# EAGLE design Thermocouple-board (EAGLE 9.3.1)
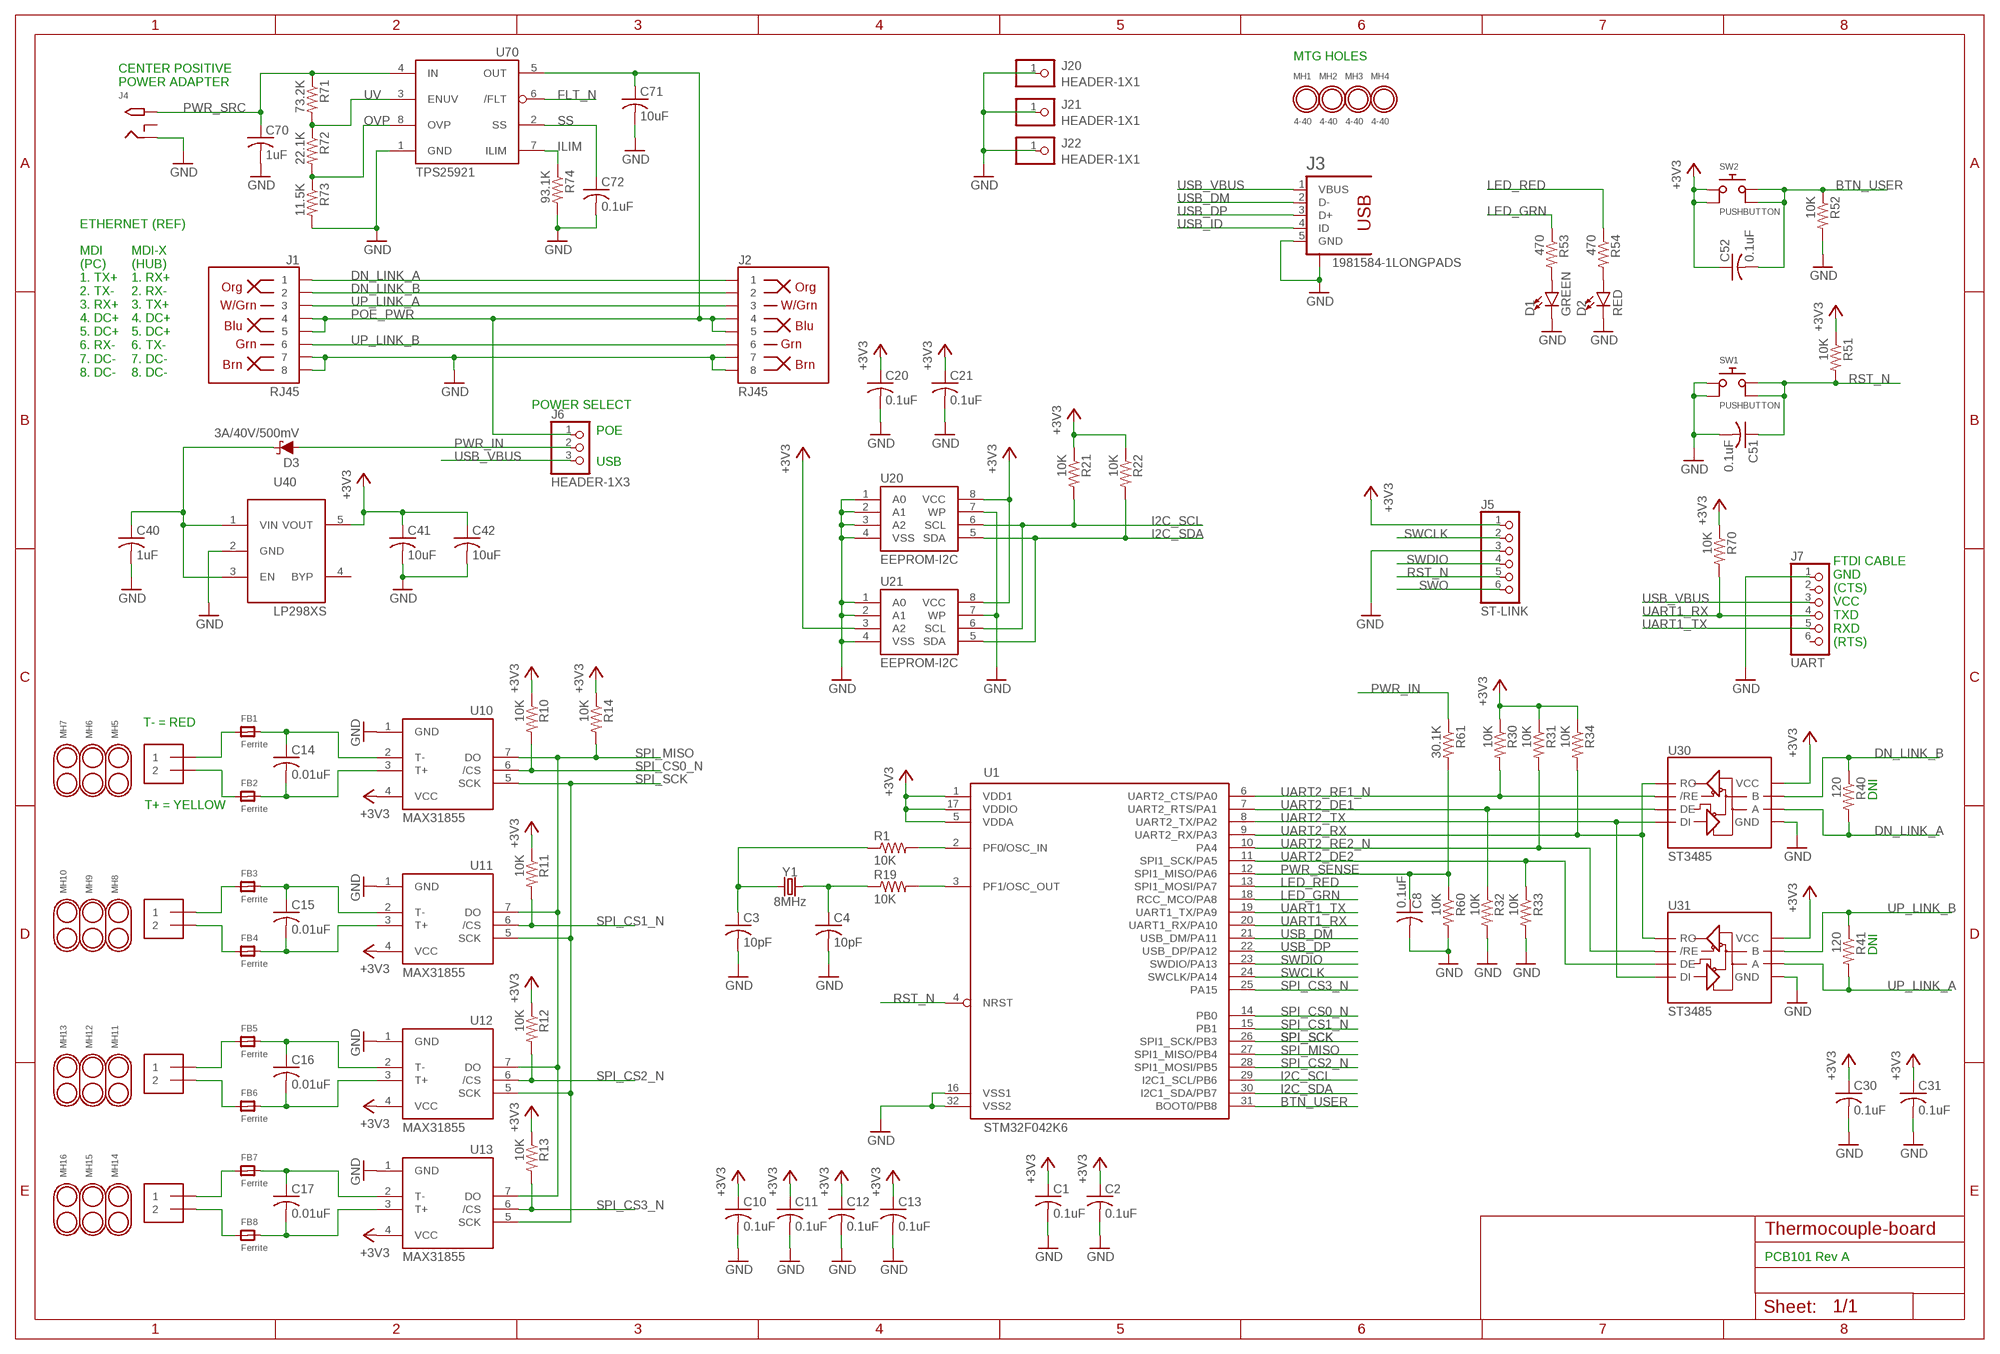
[diagram p0: schematic, sheet 1]

## Parts
C1  0.1uF  C-USC0805K  [C0805K]
C2  0.1uF  C-USC0805K  [C0805K]
C3  10pF  C-USC0805K  [C0805K]
C4  10pF  C-USC0805K  [C0805K]
C8  0.1uF  C-USC0805K  [C0805K]
C10  0.1uF  C-USC0805K  [C0805K]
C11  0.1uF  C-USC0805K  [C0805K]
C12  0.1uF  C-USC0805K  [C0805K]
C13  0.1uF  C-USC0805K  [C0805K]
C14  0.01uF  C-USC0805K  [C0805K]
C15  0.01uF  C-USC0805K  [C0805K]
C16  0.01uF  C-USC0805K  [C0805K]
C17  0.01uF  C-USC0805K  [C0805K]
C20  0.1uF  C-USC0805K  [C0805K]
C21  0.1uF  C-USC0805K  [C0805K]
C30  0.1uF  C-USC0805K  [C0805K]
C31  0.1uF  C-USC0805K  [C0805K]
C40  1uF  C-USC0805K  [C0805K]
C41  10uF  C-USC0805K  [C0805K]
C42  10uF  C-USC0805K  [C0805K]
C51  0.1uF  C-USC0805K  [C0805K]
C52  0.1uF  C-USC0805K  [C0805K]
C70  1uF  C-USC0805K  [C0805K]
C71  10uF  C-USC0805K  [C0805K]
C72  0.1uF  C-USC0805K  [C0805K]
D1  GREEN  LED-GREEN0603  [LED-0603]
D2  RED  LED-RED0603  [LED-0603]
D3  3A/40V/500mV  DIODE-SCHOTTKY-B340A  [SMA-DIODE]
FB1  Ferrite  FERRITE_0805  [_0805]
FB2  Ferrite  FERRITE_0805  [_0805]
FB3  Ferrite  FERRITE_0805  [_0805]
FB4  Ferrite  FERRITE_0805  [_0805]
FB5  Ferrite  FERRITE_0805  [_0805]
FB6  Ferrite  FERRITE_0805  [_0805]
FB7  Ferrite  FERRITE_0805  [_0805]
FB8  Ferrite  FERRITE_0805  [_0805]
J1  RJ45  RJ45-8  [RJ45-8]
J2  RJ45  RJ45-8  [RJ45-8]
J3  1981584-1LONGPADS  [1981584-1-LONG]
J4  2.1MMJACKTHM  [PJ-102A]
J5  ST-LINK  HEADER-1X6  [1X06_OVAL]
J6  HEADER-1X3  [1X03_OVAL]
J7  UART  HEADER-1X6  [1X06_OVAL]
J10  1X2-3.5MM  [1X2-3.5MM]
J11  1X2-3.5MM  [1X2-3.5MM]
J12  1X2-3.5MM  [1X2-3.5MM]
J13  1X2-3.5MM  [1X2-3.5MM]
J20  HEADER-1X1  [1X01_OVAL]
J21  HEADER-1X1  [1X01_OVAL]
J22  HEADER-1X1  [1X01_OVAL]
MH1  4-40  MTG_HOLE_4-40  [MTG_HOLE_C280_H125]
MH2  4-40  MTG_HOLE_4-40  [MTG_HOLE_C280_H125]
MH3  4-40  MTG_HOLE_4-40  [MTG_HOLE_C280_H125]
MH4  4-40  MTG_HOLE_4-40  [MTG_HOLE_C280_H125]
MH5  HOLD_DOWN  [HOLD_DOWN]
MH6  HOLD_DOWN  [HOLD_DOWN]
MH7  HOLD_DOWN  [HOLD_DOWN]
MH8  HOLD_DOWN  [HOLD_DOWN]
MH9  HOLD_DOWN  [HOLD_DOWN]
MH10  HOLD_DOWN  [HOLD_DOWN]
MH11  HOLD_DOWN  [HOLD_DOWN]
MH12  HOLD_DOWN  [HOLD_DOWN]
MH13  HOLD_DOWN  [HOLD_DOWN]
MH14  HOLD_DOWN  [HOLD_DOWN]
MH15  HOLD_DOWN  [HOLD_DOWN]
MH16  HOLD_DOWN  [HOLD_DOWN]
R1  10K  R-US_R0805  [R0805]
R10  10K  R-US_R0805  [R0805]
R11  10K  R-US_R0805  [R0805]
R12  10K  R-US_R0805  [R0805]
R13  10K  R-US_R0805  [R0805]
R14  10K  R-US_R0805  [R0805]
R19  10K  R-US_R0805  [R0805]
R21  10K  R-US_R0805  [R0805]
R22  10K  R-US_R0805  [R0805]
R30  10K  R-US_R0805  [R0805]
R31  10K  R-US_R0805  [R0805]
R32  10K  R-US_R0805  [R0805]
R33  10K  R-US_R0805  [R0805]
R34  10K  R-US_R0805  [R0805]
R40  120  R-US_R0805  [R0805]
R41  120  R-US_R0805  [R0805]
R51  10K  R-US_R0805  [R0805]
R52  10K  R-US_R0805  [R0805]
R53  470  R-US_R0805  [R0805]
R54  470  R-US_R0805  [R0805]
R60  10K  R-US_R0805  [R0805]
R61  30.1K  R-US_R0805  [R0805]
R70  10K  R-US_R0805  [R0805]
R71  73.2K  R-US_R0805  [R0805]
R72  22.1K  R-US_R0805  [R0805]
R73  11.5K  R-US_R0805  [R0805]
R74  93.1K  R-US_R0805  [R0805]
SW1  PUSHBUTTON  [PUSHBUTTON_6X6MM]
SW2  PUSHBUTTON  [PUSHBUTTON_6X6MM]
U1  STM32F042K6  STM32F042K4_V02  [TQFP32-0.8MM]
U10  MAX31855  [SO08]
U11  MAX31855  [SO08]
U12  MAX31855  [SO08]
U13  MAX31855  [SO08]
U20  EEPROM-I2C  [SO08]
U21  EEPROM-I2C  [SO08]
U30  ST3485  RS485SOIC  [SO08]
U31  ST3485  RS485SOIC  [SO08]
U40  LP298XS  [SOT23-5L]
U70  TPS25921  [SO08]
Y1  8MHz  CRYSTAL-8MHZSMD-HC49UP  [HC49UP]

## Nets
+3V3: C1.1 C2.1 C10.1 C11.1 C12.1 C13.1 C20.1 C21.1 C30.1 C31.1 C41.1 C42.1 C52.1 J5.1 R10.1 R11.1 R12.1 R13.1 R14.1 R21.1 R22.1 R30.1 R31.1 R34.1 R51.1 R70.1 SW2.1 SW2.2 U1.1(VDD1) U1.5(VDDA) U1.17(VDDIO) U10.4(VCC) U11.4(VCC) U12.4(VCC) U13.4(VCC) U20.8(VCC) U21.3(A2) U21.8(VCC) U30.8(VCC) U31.8(VCC) U40.5(VOUT)
BTN_USER: C52.2 R52.1 SW2.3 SW2.4 U1.31(BOOT0/PB8)
DN_LINK_A: J1.1 J2.1 R40.2 U30.6(A)
DN_LINK_B: J1.2 J2.2 R40.1 U30.7(B)
FLT_N: U70.6(/FLT)
GND: C1.2 C2.2 C3.2 C4.2 C8.2 C10.2 C11.2 C12.2 C13.2 C20.2 C21.2 C30.2 C31.2 C40.2 C41.2 C42.2 C51.2 C70.2 C71.2 C72.2 D1.C D2.C J1.7 J1.8 J2.7 J2.8 J3.5(GND) J3.S1 J4.RING J5.3 J7.1 J20.1 J21.1 J22.1 R32.2 R33.2 R52.2 R60.2 R73.2 R74.2 SW1.1 SW1.2 U1.16(VSS1) U1.32(VSS2) U10.1(GND) U11.1(GND) U12.1(GND) U13.1(GND) U20.1(A0) U20.2(A1) U20.3(A2) U20.4(VSS) U20.7(WP) U21.1(A0) U21.2(A1) U21.4(VSS) U21.7(WP) U30.5(GND) U31.5(GND) U40.2(GND) U70.1(GND)
I2C_SCL: R21.2 U1.29(I2C1_SCL/PB6) U20.6(SCL) U21.6(SCL)
I2C_SDA: R22.2 U1.30(I2C1_SDA/PB7) U20.5(SDA) U21.5(SDA)
ILIM: R74.1 U70.7(ILIM)
LED_GRN: R53.1 U1.18(RCC_MCO/PA8)
LED_RED: R54.1 U1.13(SPI1_MOSI/PA7)
N$1: FB1.1 J10.1
N$2: R1.2 U1.2(PF0/OSC_IN)
N$3: R19.2 U1.3(PF1/OSC_OUT)
N$4: C14.1 FB1.2 U10.2(T-)
N$5: FB2.1 J10.2
N$6: C14.2 FB2.2 U10.3(T+)
N$7: FB3.1 J11.1
N$8: C15.1 FB3.2 U11.2(T-)
N$9: FB4.1 J11.2
N$10: C15.2 FB4.2 U11.3(T+)
N$11: FB5.1 J12.1
N$12: C16.1 FB5.2 U12.2(T-)
N$13: FB6.1 J12.2
N$14: C16.2 FB6.2 U12.3(T+)
N$15: FB7.1 J13.1
N$16: C17.1 FB7.2 U13.2(T-)
N$17: FB8.1 J13.2
N$18: C17.2 FB8.2 U13.3(T+)
N$19: C4.1 R19.1 Y1.2
N$20: C3.1 R1.1 Y1.1
N$21: C40.1 D3.C U40.1(VIN) U40.3(EN)
N$25: D1.A R53.2
N$26: D2.A R54.2
OVP: R72.2 R73.1 U70.8(OVP)
POE_PWR: C71.1 J1.4 J1.5 J2.4 J2.5 J6.1 U70.5(OUT)
PWR_IN: D3.A J6.2 R61.1
PWR_SENSE: C8.1 R60.1 R61.2 U1.12(SPI1_MISO/PA6)
PWR_SRC: C70.1 J4.TIP R71.1 U70.4(IN)
RST_N: C51.1 J5.5 R51.2 SW1.3 SW1.4 U1.4(NRST)
SPI_CS0_N: R10.2 U1.14(PB0) U10.6(/CS)
SPI_CS1_N: R11.2 U1.15(PB1) U11.6(/CS)
SPI_CS2_N: R12.2 U1.28(SPI1_MOSI/PB5) U12.6(/CS)
SPI_CS3_N: R13.2 U1.25(PA15) U13.6(/CS)
SPI_MISO: R14.2 U1.27(SPI1_MISO/PB4) U10.7(DO) U11.7(DO) U12.7(DO) U13.7(DO)
SPI_SCK: U1.26(SPI1_SCK/PB3) U10.5(SCK) U11.5(SCK) U12.5(SCK) U13.5(SCK)
SS: C72.1 U70.2(SS)
SWCLK: J5.2 U1.24(SWCLK/PA14)
SWDIO: J5.4 U1.23(SWDIO/PA13)
SWO: J5.6
UART1_RX: J7.4 R70.2 U1.20(UART1_RX/PA10)
UART1_TX: J7.5 U1.19(UART1_TX/PA9)
UART2_DE1: R32.1 U1.7(UART2_RTS/PA1) U30.3(DE)
UART2_DE2: R33.1 U1.11(SPI1_SCK/PA5) U31.3(DE)
UART2_RE1_N: R30.2 U1.6(UART2_CTS/PA0) U30.2(/RE)
UART2_RE2_N: R31.2 U1.10(PA4) U31.2(/RE)
UART2_RX: R34.2 U1.9(UART2_RX/PA3) U30.1(RO) U31.1(RO)
UART2_TX: U1.8(UART2_TX/PA2) U30.4(DI) U31.4(DI)
UP_LINK_A: J1.3 J2.3 R41.2 U31.6(A)
UP_LINK_B: J1.6 J2.6 R41.1 U31.7(B)
USB_DM: J3.2(D-) U1.21(USB_DM/PA11)
USB_DP: J3.3(D+) U1.22(USB_DP/PA12)
USB_ID: J3.4(ID)
USB_VBUS: J3.1(VBUS) J6.3 J7.3
UV: R71.2 R72.1 U70.3(ENUV)
Unconnected: J4.RING_SW J7.2 J7.6 U40.4(BYP)

## Notes on the sheet
- MTG HOLES
- CENTER POSITIVE
  POWER ADAPTER
- ETHERNET (REF)
- MDI
  (PC)
  1. TX+
  2. TX-
  3. RX+
  4. DC+
  5. DC+
  6. RX-
  7. DC-
  8. DC-
- MDI-X
  (HUB)
  1. RX+
  2. RX-
  3. TX+
  4. DC+
  5. DC+
  6. TX-
  7. DC-
  8. DC-
- POWER SELECT
- POE
- USB
- FTDI CABLE
  GND
  (CTS)
  VCC
  TXD
  RXD
  (RTS)
- T- = RED
- DNI
- T+ = YELLOW
- DNI
- PCB101 Rev A

## Library data of the parts
C1-C4 C8 C10-C17 C20 C21 C30 C31 C40-C42 C51 C52 C70-C72 = adafruit:C-US: CAPACITOR, American symbol
D1 = SparkFun-LED:LED-GREEN: Green SMD LED Used in manufacturing of various products at SparkFun Packages: 0603 - SMD 0603 package [Product Link] <http://www.futureelectronics.com/en/technologies/semiconductors/optoelectronics/leds/Pages/9894312-LTST-C190GKT.aspx?CrossPart=HSMG-C190&IM=0> LilyPad 1206 - SMD1206 LilyPad package [Product Link] <http://www.futureelectronics.com/en/Technologies/Product.aspx?ProductID=IN150NGHARVATEKCORPORATION2049943&IM=0> 1206 - SMD1206 package [Product Link] <http://www.futureelectronics.com/en/technologies/semiconductors/optoelectronics/leds/Pages/8315665-LTST-C150KGKT.aspx?IM=0> 1206 Bottom Mount -SMD 1206 Bottom Mount [Product Link] <http://www.digikey.com/product-detail/en/lite-on-inc/LTST-C230KGKT/160-1456-1-ND/386854> SparkFun Products: Pro Mini 328 -5V <https://www.sparkfun.com/products/821> RedBoard <https://www.sparkfun.com/products/12757> MP3 Trigger <https://www.sparkfun.com/products/13720> Makey Makey <https://www.sparkfun.com/products/11076>; PROD_ID: DIO-00821
D2 = SparkFun-LED:LED-RED: Red SMD LED Used in manufacturing of most products at SparkFun Packages: 0603 - SMD 0603 package [Product Link] <http://docs.avagotech.com/docs/AV02-0551EN> 0603 SMART - SMD 0603 SMART package ( more efficient and expensive)[Product Link] <http://www.osram-os.com/Graphics/XPic2/00077099_0.pdf> 1206 - SMD1206 package [Product Link] <https://www.sparkfun.com/datasheets/DevTools/LilyPad/Q150OVS4.pdff> SparkFun Products: Pro Mini 328 -5V <https://www.sparkfun.com/products/821> RedBoard <https://www.sparkfun.com/products/12757> IOIO-OTG <https://www.sparkfun.com/products/13613>; PROD_ID: DIO-00819
D3 = SparkFun-DiscreteSemi:DIODE-SCHOTTKY: Schottky diode A Schottky diode is a semiconductor diode which has a low forward voltage drop and a very fast switching action.; PROD_ID: DIO-09886
FB1-FB8 = microbuilder:FERRITE: Ferrite Bead 0603 MMZ1608B121C - 120 Ohm @ 100MHz, 600mA, 0.15 Ohm DC Resistance - Digikey: 445-2164-1-ND BK1608HW121-T - 120 Ohm, 600mA Ferrite Chip - Digikey: 587-1876-2-ND 0805 HZ0805B272R-10 - 2.7K Ohm @ 100MHz, 200mA, 0.8 Ohm DC Resistance - Digikey: 240-2504-1-ND (see also Murata BLM21BD272SN1L) MMZ2012Y152B - 1.5K Ohm @ 100MHz, 500mA, 0.4 Ohm DC Resistance - Digikey: 445-1560-1-ND - Mainly for high frequency (80-400MHz) MMZ2012R102A - 1K Ohm @ 100MHz, 500mA, 0.3 Ohm DC Resistance - Digikey: 445-1555-2-ND - More general purpose (10-200MHz)
J1 J2 = SparkFun-Connectors:RJ45-8: RJ45 Jack - 8 pin Simple RJ45, 8-pin connection. Commonly used for Cat5, Cat5e, and Cat6 Ethernet cables. Here is the connector we sell at SparkFun: RJ45 8-Pin Connector <https://www.sparkfun.com/products/643> (PRT-00643) Datasheet <https://cdn.sparkfun.com/datasheets/Prototyping/04908.pdf> It is used on this SparkFun product: SparkFun RJ45 Breakout <https://www.sparkfun.com/products/716> (BOB-00716) Note, you may also be interested in the "MAGJACK" version of this. It is basically a RJ45 connector, but also has some status LEDs built into the connector housing. You can check that out in this library at the device named "MAGJACK.dev" and see these products online: RJ45 Ethernet MagJack-Compatible <https://www.sparkfun.com/products/8534> (PRT-08534) SparkFun RJ45 MagJack Breakout <https://www.sparkfun.com/products/13021> (BOB-13021); PROD_ID: CONN-08506; SF_ID: PRT-00643
J3 = Thermocouple-board:1981584-1: Receptacle, micro-USB, type A/B Tyco Electronics
J4 = Thermocouple-board:2.1MMJACK: 2.1mm x 5.5mm THM DC jack with internal switch. Digikey part #PJ-102A, 4UCON part #05537
J5 J7 = Thermocouple-board:HEADER-1X6: PIN HEADER
J6 = Thermocouple-board:HEADER-1X3: PIN HEADER
J10-J13 = Thermocouple-board:1X2: 3.5mm Terminal block http://www.ladyada.net/library/pcb/eaglelibrary.html
J20-J22 = Thermocouple-board:HEADER-1X1: PIN HEADER
MH1-MH4 = Thermocouple-board:MTG_HOLE
MH5-MH16 = Thermocouple-board:HOLD_DOWN
R1 R10-R14 R19 R21 R22 R30-R34 R40 R41 R51-R54 R60 R61 R70-R74 = adafruit:R-US_: RESISTOR, American symbol
SW1 SW2 = Thermocouple-board:PUSHBUTTON: C&K PTS645-Seriesl (6x6mm) SMT Tactile Pushbiutton Switch
U1 = Thermocouple-board:STM32F042K4_V02: STM32F030K6, Cortex-M0, 32K Flash, 4K SRAM, 48MHz, LQFP32 0.8mm
U10-U13 = Thermocouple-board:MAX31855: MAX31855 Cold-Junction Compensated Thermocouple-to-Digital Converter
U20 U21 = Thermocouple-board:EEPROM-I2C
U30 U31 = SparkFun-IC-Comms:RS485: RS-485 Transceiver SP3485 Series 8 Pin NSOIC 3.3 V Low Power Half Duplex RS-485 Transceiver MAX3485 compatible Datasheet <http://www.sparkfun.com/datasheets/Components/General/sp3485CN-LTR.pdf> SparkFun Products SparkFun Transceiver Breakout - RS-485 <https://www.sparkfun.com/products/10124> (BOB-10124) SparkFun USB to RS-485 Converter <https://www.sparkfun.com/products/9822> (BOB-09822); PROD_ID: IC-09388; VALUE: MAX3485CSA
U40 = adafruit:LP298X
U70 = Thermocouple-board:TPS25921: TPS25921 4.5V to 18V eFuse with Current Limit and Over Voltage Protection in SOIC 8-pin.
Y1 = SparkFun-Clocks:CRYSTAL-8MHZ: 8MHz Crystal Datasheet Example <http://www.futureelectronics.com/en/technologies/electromechanical/timing-devices/crystals/Pages/6008189-ABM3B-8.000MHZ-B2-T.aspx?IM=0> Frequency: 8MHz Frequency Tolerance: ±20ppm Load Capacitance: 18pF SparkFun Products: Pro Micro -3.3V/8MHz <https://www.sparkfun.com/products/12587> WAV Trigger <https://www.sparkfun.com/products/13660>; PROD_ID: XTAL-11706

## Net classes
0 default: width 0.203 mm, clearance 0.203 mm
1 pwr_gnd: width 0.813 mm, clearance 0.254 mm

## Board
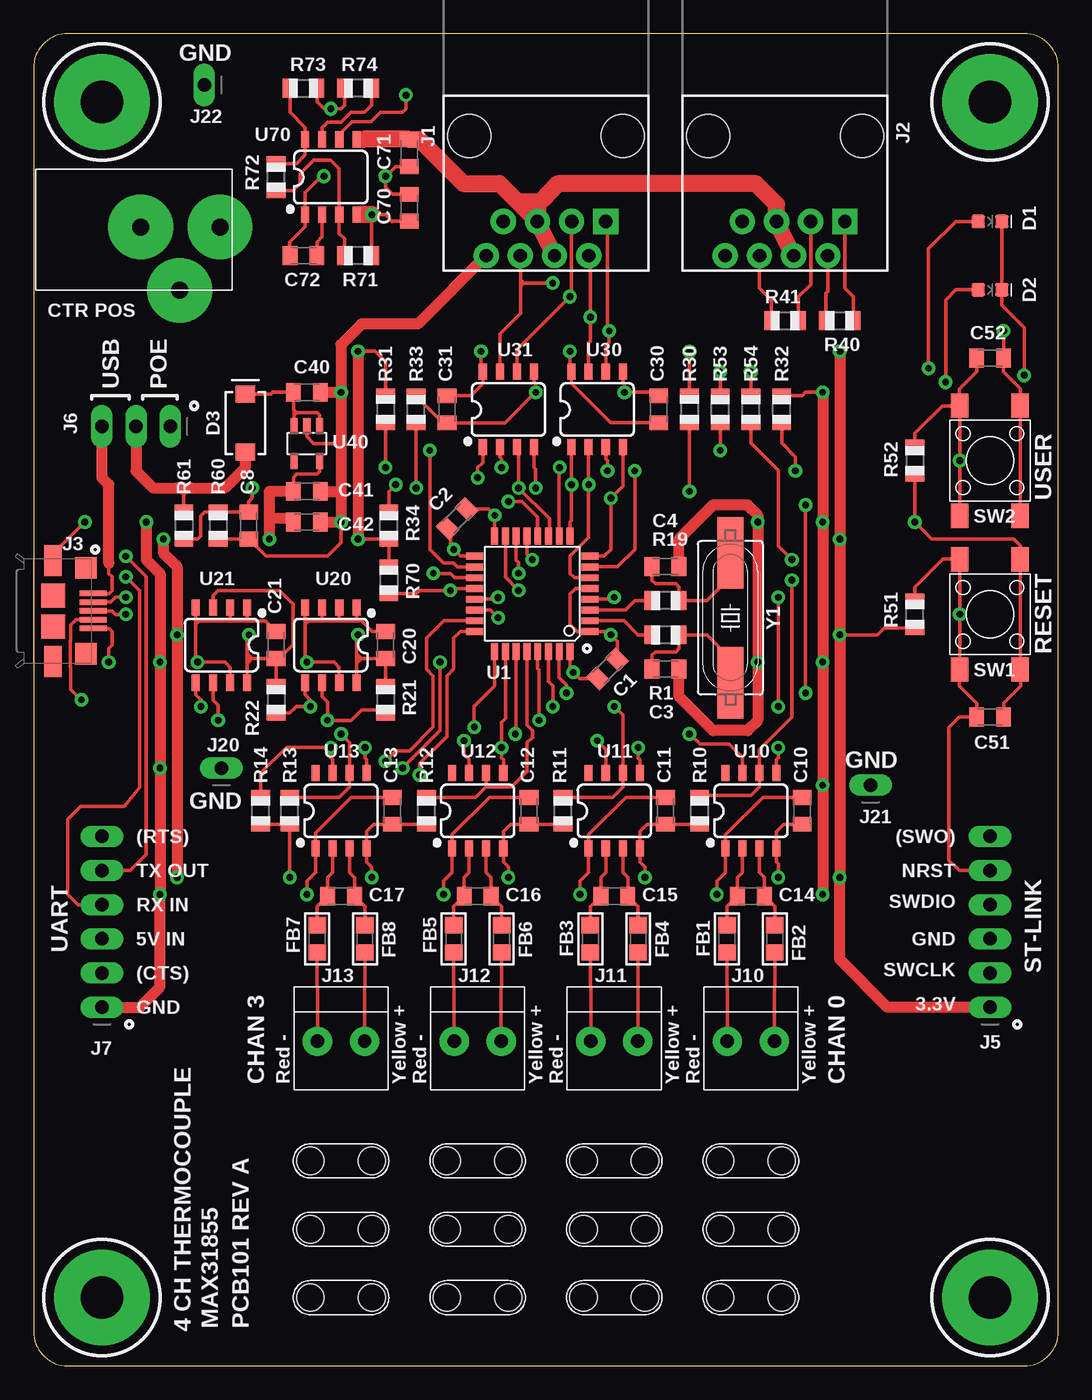
[diagram p1: board, top side]
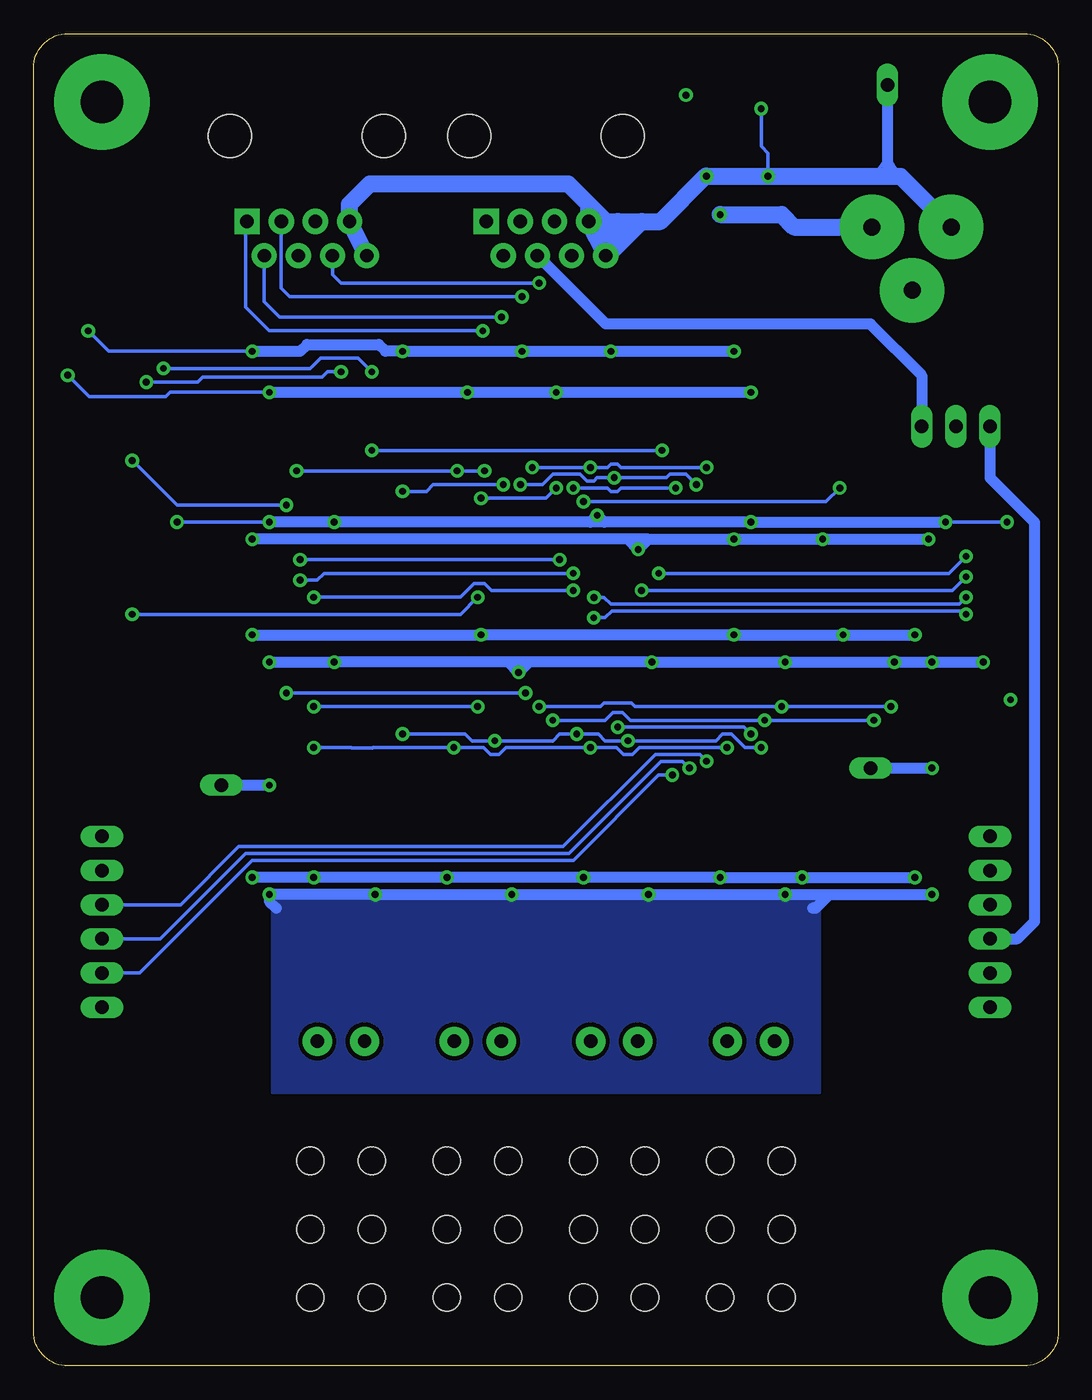
[diagram p2: board, bottom side, seen from below]

Size 76.2 x 99.06 mm. Coordinates in mm from the lower left corner, seen from the top.
Outline: 76.2,96.52 arc90 73.66,99.06 2.54,99.06 arc90 0,96.52 0,2.54 arc90 2.54,0 73.66,0 arc90 76.2,2.54 76.2,96.52
Copper layers (1*16): Top 0.035mm / dielectric 1.5mm / Bottom 0.035mm
Design rules "SparkFun-design-rules *": minimum track width 8mil, minimum drill 20mil, track to track 10mil, track to pad 8mil, pad to pad 8mil, via to via 10mil, smd to smd 8mil, copper to edge 10mil, drill to drill 8mil, minimum pad ring 12mil, minimum via ring 10mil, stop-mask expansion 4mil, vias tented up to drill 25mil, thermal gap 10mil

### Footprints (pad centres in the part's own frame; a part is rotated, then mirrored left to right if it is on the bottom)
C0805K = smd 1.1 x 1.4: 1 -1,0; 2 1,0
LED-0603 = smd 1 x 1: A -0.877,0; C 0.877,0
SMA-DIODE = smd 1.27 x 1.47: A -2.15,0; C 2.15,0
_0805 = smd 1.2 x 1.3: 1 -1.016,0; 2 1.016,0
RJ45-8 = drill 1 pad 1.88 square: 1 -4.445,6.35 | drill 1 pad 1.88: 2 -3.175,8.89; 3 -1.905,6.35; 4 -0.635,8.89; 5 0.635,6.35; 6 1.905,8.89; 7 3.175,6.35; 8 4.445,8.89 | hole 3.2: -5.715,0; 5.715,0
1981584-1-LONG = smd 0.4 x 2: 1 -1.3,4.425; 2 -0.65,4.425; 3 0,4.425; 4 0.65,4.425; 5 1.3,4.425 | smd 1.8 x 1.8: M1 -1.15,1.45; M2 1.15,1.45 | smd 2.3 x 1.3: S1 -3.75,1.45; S2 3.75,1.45 | smd 1.6 x 1.6: S3 -3.2,3.885; S4 3.2,3.885
PJ-102A = drill 1.27 pad 4.8: RING 0.1,-3.39; RING_SW -4.6,-6.29; TIP 0.1,-9.29
1X06_OVAL = drill 1 long: 1 -6.35,0; 2 -3.81,0; 3 -1.27,0; 4 1.27,0; 5 3.81,0; 6 6.35,0
1X03_OVAL = drill 1 long: 1 -2.54,0; 2 0,0; 3 2.54,0
1X2-3.5MM = drill 1 pad 2.184: 1 1.75,0; 2 -1.75,0
1X01_OVAL = drill 1 long: 1 0,0
MTG_HOLE_C280_H125 = drill 3.175 pad 7.112: 1 0,0
HOLD_DOWN = hole 2.032: 2.286,0; -2.286,0
R0805 = smd 1.1 x 1.4: 1 -1,0; 2 1,0
PUSHBUTTON_6X6MM = smd 1.8 x 1.3: 1 -4.1,2.25; 2 4.1,2.25; 3 -4.1,-2.25; 4 4.1,-2.25
TQFP32-0.8MM = smd 1.27 x 0.508: 1 -4.293,2.8; 2 -4.293,2; 3 -4.293,1.2; 4 -4.293,0.4; 5 -4.293,-0.4; 6 -4.293,-1.2; 7 -4.293,-2; 8 -4.293,-2.8; 17 4.293,-2.8; 18 4.293,-2; 19 4.293,-1.2; 20 4.293,-0.4; 21 4.293,0.4; 22 4.293,1.2; 23 4.293,2; 24 4.293,2.8 | smd 0.508 x 1.27: 9 -2.8,-4.293; 10 -2,-4.293; 11 -1.2,-4.293; 12 -0.4,-4.293; 13 0.4,-4.293; 14 1.2,-4.293; 15 2,-4.293; 16 2.8,-4.293; 25 2.8,4.293; 26 2,4.293; 27 1.2,4.293; 28 0.4,4.293; 29 -0.4,4.293; 30 -1.2,4.293; 31 -2,4.293; 32 -2.8,4.293
SO08 = smd 0.6 x 1.2: 1 -1.905,-2.8; 2 -0.635,-2.8; 3 0.635,-2.8; 4 1.905,-2.8; 5 1.905,2.8; 6 0.635,2.8; 7 -0.635,2.8; 8 -1.905,2.8
SOT23-5L = smd 0.55 x 1.2: 1 -0.95,-1.3; 2 0,-1.3; 3 0.95,-1.3; 4 0.95,1.3; 5 -0.95,1.3
HC49UP = smd 5.334 x 1.93: 1 -4.826,0; 2 4.826,0

### Placement (x,y rotation side)
C1  42.67,51.82 225 top
C2  31.5,62.99 45 top
C3  46.99,51.82 0 top
C4  46.99,59.44 0 top
C8  16,62.48 270 top
C10  57.15,41.27 90 top
C11  46.99,41.27 90 top
C12  36.83,41.27 90 top
C13  26.67,41.27 90 top
C14  53.34,34.92 0 top
C15  43.18,34.92 0 top
C16  33.02,34.92 0 top
C17  22.86,34.92 0 top
C20  26.16,53.59 90 top
C21  18.03,53.59 90 top
C30  46.48,71.12 90 top
C31  30.73,71.12 270 top
C40  20.32,72.39 0 top
C41  20.32,65.02 0 top
C42  20.32,62.74 0 top
C51  71.12,48.26 0 top
C52  71.12,74.93 180 top
C70  27.94,86.11 90 top
C71  27.94,90.17 270 top
C72  20.07,82.55 180 top
D1  71.12,85.09 0 top
D2  71.12,80.01 0 top
D3  15.75,70.1 90 top
FB1  51.56,31.75 90 top
FB2  55.12,31.75 90 top
FB3  41.4,31.75 90 top
FB4  44.96,31.75 90 top
FB5  31.24,31.75 90 top
FB6  34.8,31.75 90 top
FB7  21.08,31.75 90 top
FB8  24.64,31.75 90 top
J1  38.1,91.44 180 top
J2  55.88,91.44 180 top
J3  0,56.13 270 top
J4  4.57,84.58 90 top
J5  71.12,33.02 90 top
J6  7.62,69.85 180 top
J7  5.08,33.02 90 top
J10  53.34,24.13 180 top
J11  43.18,24.13 180 top
J12  33.02,24.13 180 top
J13  22.86,24.13 180 top
J20  13.97,44.45 90 top
J21  62.23,43.18 90 top
J22  12.7,95.25 180 top
MH1  5.08,5.08 0 top
MH2  71.12,5.08 0 top
MH3  5.08,93.98 0 top
MH4  71.12,93.98 0 top
MH5  53.34,15.24 0 top
MH6  53.34,10.16 0 top
MH7  53.34,5.08 0 top
MH8  43.18,15.24 0 top
MH9  43.18,10.16 0 top
MH10  43.18,5.08 0 top
MH11  33.02,15.24 0 top
MH12  33.02,10.16 0 top
MH13  33.02,5.08 0 top
MH14  22.86,15.24 0 top
MH15  22.86,10.16 0 top
MH16  22.86,5.08 0 top
R1  46.99,54.36 180 top
R10  49.53,41.27 90 top
R11  39.37,41.27 90 top
R12  29.21,41.27 90 top
R13  19.05,41.27 90 top
R14  16.89,41.27 90 top
R19  46.99,56.9 180 top
R21  26.16,49.53 270 top
R22  18.03,49.53 270 top
R30  48.77,71.12 270 top
R31  26.16,71.12 270 top
R32  55.63,71.12 90 top
R33  28.45,71.12 90 top
R34  26.42,62.48 90 top
R40  59.94,77.72 0 top
R41  55.88,77.72 0 top
R51  65.53,55.88 90 top
R52  65.53,67.31 270 top
R53  51.05,71.12 90 top
R54  53.34,71.12 90 top
R60  13.72,62.48 270 top
R61  11.18,62.48 270 top
R70  26.42,58.42 270 top
R71  24.13,82.55 180 top
R72  18.03,88.39 90 top
R73  20.07,95 0 top
R74  24.13,95 180 top
SW1  71.12,55.88 270 top
SW2  71.12,67.31 270 top
U1  37.08,57.4 180 top
U10  53.34,41.27 0 top
U11  43.18,41.27 0 top
U12  33.02,41.27 0 top
U13  22.86,41.27 0 top
U20  22.1,53.59 180 top
U21  13.97,53.59 180 top
U30  41.91,71.12 0 top
U31  35.31,71.12 0 top
U40  20.32,68.58 180 top
U70  22.1,88.39 0 top
Y1  51.82,55.63 90 top

### Tracks (layer width: path | path; a pad name or v marks a point on that pad's centre or on a via)
+3V3  (via drill 0.51)
  Top 0.254: v25.15,36.32 25.15,37.08 24.77,37.47 U13.4 24.77,39.75 25.29,40.27 C13.1 R12.1 | C31.1 30.75,72.14 32.51,72.14 33.4,73.03 U31.8 33.4,74.04 33.27,74.17 v33.27,75.44 | C30.1 42.91,70.12 40.01,73.03 U30.8 40.01,74.04 39.88,74.17 v39.88,75.44 | v48.77,75.44 R30.1 | C2.1 30.99,62.09 30.99,60.96 v31.24,60.71 31.74,60.2 U1.17 | R10.1 C11.1 45.61,40.27 45.09,39.75 U11.4 45.09,37.47 45.47,37.08 v45.47,36.32 | R14.1 R13.1 v19.05,36.32 | R11.1 C12.1 35.45,40.27 34.92,39.75 U12.4 34.92,37.47 35.31,37.08 v35.31,36.32 | U1.5 40.28,57.8 39.88,57.4 39.88,55.12 40.39,54.6 U1.1 42.68,54.6 v42.93,54.36 43.43,53.85 43.43,52.58 C1.1 | C21.1 18.26,52.59 19.3,53.64 19.3,56.64 18.29,57.66 13.72,57.66 13.34,57.28 U21.3 | R21.1 C20.1 24.38,52.59 | R22.1 C21.1 | U40.5 21.27,66.48 21.08,66.29 19.56,66.29 19.32,66.06 C41.1 | v24.13,75.44 25.4,75.44 26.16,74.68 R31.1 | v24.13,61.47 26.4,61.47 R34.1 R70.1 | SW2.2 SW2.1 73.37,72.68 72.12,73.93 C52.1 71.87,75.18 72.14,75.45 v72.14,76.96 | v55.37,36.32 55.37,37.34 55.24,37.47 U10.4 55.24,39.75 55.77,40.27 C10.1 | U20.8 24,52.07 24,52.21 | 24,52.21 24,52.59 | 24,52.59 24.38,52.59 | 24,52.59 24,52.98 | 24,52.98 24,54.23 v24.13,54.36 | U21.8 15.88,52.2 | 15.88,52.2 15.88,52.58 | 15.88,52.58 15.88,52.96 | 15.88,52.96 15.88,54.23 v16,54.36 | C21.1 18.02,52.58 16.26,52.58 | 16.26,52.58 15.88,52.58 | v59.94,54.36 62.74,54.36 63.26,54.88 R51.1 | 16.26,52.58 15.88,52.96 | 16.26,52.58 15.88,52.2 | 24.38,52.59 24,52.98 | 24.38,52.59 24,52.21
  Top 0.813: v9.65,61.47 9.65,60.45 10.67,59.44 v10.67,54.36 v10.67,36.32 | v59.94,75.44 v59.94,61.47 v59.94,54.36 v59.94,36.32 59.94,30.23 63.5,26.67 J5.1 | v24.13,75.44 v24.13,61.47 | 17.53,62.99 17.53,65.02 C41.1 | 17.53,62.99 v17.53,61.47 | C42.1 19.07,62.99 17.53,62.99
  Bottom 0.254: v59.94,75.44 70.61,75.44 v72.14,76.96
  Bottom 0.813: v24.13,75.44 v33.27,75.44 v39.88,75.44 v48.77,75.44 50.04,75.44 50.55,75.95 55.88,75.95 56.39,75.44 v59.94,75.44 | 30.48,61.47 v24.13,61.47 v17.53,61.47 v9.65,61.47 | 30.48,61.47 v31.24,60.71 32,61.47 | v10.67,36.32 v19.05,36.32 v25.15,36.32 v35.31,36.32 v45.47,36.32 v55.37,36.32 v59.94,36.32 | 32,61.47 v59.94,61.47 | 30.48,61.47 32,61.47 | v59.94,54.36 v42.93,54.36 v24.13,54.36 v16,54.36 v10.67,54.36
BTN_USER  (via drill 0.51)
  Top 0.254: v57.4,64.01 v57.4,50.04 | v39.62,50.04 39.62,50.63 39.08,51.17 U1.31 | SW2.4 v68.87,67.31 SW2.3 | SW2.3 68.83,71.45 68.83,72.64 70.12,73.93 C52.2 | SW2.3 68.83,71.37 67.56,71.37 65.53,69.34 R52.1
  Bottom 0.254: v57.4,50.04 v39.62,50.04 | v57.4,64.01 65.53,64.01 68.83,67.31 v68.87,67.31
DN_LINK_A  (via drill 0.51)
  Top 0.254: J1.1 42.67,84.96 42.67,77.09 v42.8,76.96 42.8,76.07 42.55,75.82 U30.6 | J2.1 60.33,80.14 60.94,79.52 R40.2
  Bottom 0.254: v42.8,76.96 58.67,76.96 60.45,78.74 60.45,84.96 J2.1
DN_LINK_B  (via drill 0.51)
  Top 0.254: J1.2 41.4,82.42 v41.4,77.98 41.4,76.2 41.27,76.07 U30.7 | J2.2 59.05,79.88 58.93,79.76 58.93,77.74 R40.1
  Bottom 0.254: v41.4,77.98 57.91,77.98 59.05,79.12 J2.2
FLT_N  (via drill 0.51)
  Top 0.254: U70.6 22.86,91.32 22.86,91.69 23.68,92.51 25.09,92.51 25.79,93.22 27.43,93.22 27.69,93.47 v27.69,94.49
GND  (via drill 0.51)
  Top 0.254: C1.2 40.59,51.11 v40.13,51.56 39.88,51.81 U1.32 | C30.2 46.21,72.39 v43.94,72.39 43.94,72.9 43.81,73.03 U30.5 | U1.16 v34.28,63.24 v34.29,63.25 33.84,63.7 C2.2 | v30.23,52.32 30.23,47.24 v27.43,44.45 | U40.2 20.32,69.09 20.83,68.58 22.86,68.58 | J3.S1 1.45,60.39 3.8,62.74 v3.81,62.74 | R33.2 30.46,70.1 30.72,70.1 C31.2 30.75,70.1 35.05,70.1 v37.34,72.39 37.34,73.03 37.21,73.15 U31.5 | R60.2 C8.2 17.29,60.2 21.84,60.2 22.86,61.21 v22.86,62.74 | U21.4 12.06,55.5 | 12.06,55.5 12.06,55.37 | 12.06,55.37 12.06,55.12 | 12.06,55.12 12.06,52.45 v12.19,52.32 14.22,52.32 14.61,51.94 U21.7 | U20.4 20.19,55.63 | 20.19,55.63 20.19,55.37 | 20.19,55.37 20.19,55.12 | 20.19,55.12 20.19,52.45 v20.32,52.32 22.35,52.32 22.73,51.94 U20.7 | C21.2 17.26,55.37 16,55.37 | 16,55.37 15.75,55.37 | 15.75,55.37 14.73,55.37 | 14.73,55.37 14.48,55.37 | 14.48,55.37 12.32,55.37 | 12.32,55.37 12.19,55.37 | 12.19,55.37 12.06,55.37 | U21.2 14.61,55.5 | 14.61,55.5 14.73,55.37 | U21.1 15.88,55.5 | 15.88,55.5 16,55.37 | C20.2 25.16,54.59 24.38,55.37 24.13,55.37 | 24.13,55.37 23.88,55.37 | 23.88,55.37 22.86,55.37 | 22.86,55.37 22.61,55.37 | 22.61,55.37 21.59,55.37 | 21.59,55.37 21.34,55.37 | 21.34,55.37 20.45,55.37 | 20.45,55.37 20.19,55.37 | U20.3 21.46,55.5 | 21.46,55.5 21.59,55.37 | U20.2 22.73,55.5 | 22.73,55.5 22.86,55.37 | R52.2 v65.53,62.74 66.8,61.47 72.9,61.47 73.37,61 SW1.1 SW1.2 73.41,51.74 73.41,50.55 72.14,49.28 72.14,48.28 C51.2 | v20.32,35.05 20.32,36.07 20.95,36.7 U13.1 20.96,39.62 23.62,42.27 C13.2 | v30.48,35.05 30.48,36.07 31.11,36.7 U12.1 31.11,39.5 33.89,42.27 C12.2 | v40.64,35.05 40.64,36.07 41.27,36.7 U11.1 41.27,39.5 44.05,42.27 C11.2
  Top 0.254: v50.8,35.05 50.8,36.07 51.44,36.7 U10.1 51.44,39.5 54.21,42.27 C10.2 | U20.1 24,55.5 | 24,55.5 24.13,55.37 | 20.19,55.63 20.45,55.37 | 20.19,55.12 20.45,55.37 | 21.46,55.5 21.34,55.37 | 22.73,55.5 22.61,55.37 | 24,55.5 23.88,55.37 | 14.61,55.5 14.48,55.37 | 15.88,55.5 15.75,55.37 | 12.06,55.5 12.19,55.37 | 12.06,55.12 12.32,55.37 | J3.5 5.62,54.83 5.84,54.61 5.84,53.59 5.59,53.34 v5.59,52.32 | R32.2 55.64,72.14 57.15,72.14 57.4,72.39 v58.67,72.39 | D1.C D2.C 72,78.88 73.66,77.22 v73.66,73.66 | C71.2 27.92,89.15 26.92,89.15 26.22,88.45 v26.16,88.45 26.16,87.63 26.69,87.11 C70.2 | C72.2 19.05,82.57 19.05,83.57 20.19,84.71 U70.1 20.19,87.25 21.4,88.45 v21.59,88.45 | R74.2 23.13,93.74 22.86,93.47 v22.1,93.47 21.59,93.47 21.07,94 R73.2
  Top 0.813: v8.38,62.74 8.38,59.94 9.4,58.93 v9.4,52.32 v9.4,44.45 v9.4,35.05 9.4,28.19 7.87,26.67 J7.1 | v22.86,72.39 22.86,68.58 22.86,65.02 | 22.86,65.02 v22.86,62.74 C42.2 | C4.2 47.99,61.47 50.53,64.01 53.09,64.01 53.85,63.25 v53.85,62.74 v53.85,52.32 53.85,48.01 53.09,47.24 50.53,47.24 47.99,49.78 C3.2 | v58.67,72.39 v58.67,62.74 v58.67,52.32 v58.67,43.18 v58.67,35.05 | C40.2 v22.86,72.39 | C41.2 22.86,65.02 | J1.8 28.57,77.47 24.38,77.47 22.86,75.95 v22.86,72.39
  Bottom 0.254: J5.3 66.8,31.75 60.45,38.1 36.4,38.1 29.54,44.96 27.94,44.96 v27.43,44.45 | v8.38,62.74 v3.81,62.74 | v58.67,62.74 v65.53,62.74 | v58.67,72.39 66.04,72.39 66.37,72.06 72.06,72.06 v73.66,73.66 | v22.1,93.47 22.1,90.68 21.59,90.17 v21.59,88.45 | 11.73,88.45 11.85,88.62 12.7,89.92 13.72,88.45
  Bottom 0.813: v22.86,72.39 v37.34,72.39 v43.94,72.39 v58.67,72.39 | 33.78,62.74 v22.86,62.74 v8.38,62.74 | 33.78,62.74 v34.29,63.25 34.8,62.74 | 17.02,35.05 v20.32,35.05 v30.48,35.05 v40.64,35.05 v50.8,35.05 v58.67,35.05 58.67,34.54 58.17,34.04 | 17.02,35.05 v9.4,35.05 | 39.37,52.32 v40.13,51.56 40.89,52.32 | 39.37,52.32 v30.23,52.32 v20.32,52.32 v12.19,52.32 v9.4,52.32 v5.59,52.32 | v58.67,52.32 v53.85,52.32 40.89,52.32 | 34.8,62.74 v53.85,62.74 v58.67,62.74 | 39.37,52.32 40.89,52.32 | 33.78,62.74 34.8,62.74 | 26.2,88.49 v26.16,88.45 | J21.1 v58.67,43.18 | J20.1 v9.4,44.45 | J22.1 12.7,89.92 12.7,88.45 | 17.02,35.05 18.03,34.04 18.29,34.04
  Bottom 1.27: J1.7 32.77,85.09 | 32.77,85.09 30.99,85.09 | 30.99,85.09 29.59,85.09 26.2,88.49 | J1.8 J1.7 | J2.8 J2.7 52.7,86.36 51.18,87.88 36.45,87.88 34.92,86.36 | 34.92,86.36 J1.7 | v26.16,88.45 v21.59,88.45 13.72,88.45 12.7,88.45 11.73,88.45 J4.RING | 34.92,86.36 33.91,85.34 33.91,82.8 J1.8 | J1.8 33.53,82.55 30.99,85.09 | J1.8 32.77,83.44 32.77,85.09
  pour Bottom (isolate 0.305): 17.78,35.05 17.78,20.32 58.42,20.32 58.42,35.05
I2C_SCL  (via drill 0.51)
  Top 0.254: R21.2 25.92,48.77 24.38,48.77 23.62,48.01 v21.84,48.01 21.84,49.38 21.46,49.76 U20.6 | v13.72,48.01 13.72,49.12 13.34,49.51 U21.6 | v37.59,48.01 37.59,51.73 37.48,51.84 U1.29
  Bottom 0.254: v13.72,48.01 v21.84,48.01 31.84,48.01 32.42,48.59 33.11,48.59 33.7,48.01 v37.59,48.01
I2C_SDA  (via drill 0.51)
  Top 0.254: v12.45,49.02 12.45,49.53 12.06,49.91 U21.5 | U20.5 20.19,49.91 20.57,49.53 v20.57,49.02 20.56,49.04 19.56,49.04 19.05,48.53 R22.2 | v38.61,49.02 38.61,50.55 38.28,50.87 U1.30
  Bottom 0.254: v12.45,49.02 v20.57,49.02 31.5,49.02 31.75,49.28 33.78,49.28 34.04,49.02 v38.61,49.02
ILIM
  Top 0.254: U70.7 21.46,92.08 21.84,92.46 22.86,92.46 23.62,93.22 24.62,93.22 25.13,93.73 R74.1
LED_GRN  (via drill 0.51)
  Top 0.254: U1.18 31.52,59.4 31.23,59.69 30.48,59.69 29.46,60.71 v29.46,68.07 | R53.1 v51.05,68.07
  Bottom 0.254: v29.46,68.07 v51.05,68.07
LED_RED  (via drill 0.51)
  Top 0.254: U1.13 36.68,60.34 v37.08,59.94 | R54.1 53.34,68.6 55.37,66.56 55.37,60.96 v56.39,59.94
  Bottom 0.254: v56.39,59.94 v37.08,59.94
N$1
  Top 0.254: J10.1 51.59,28.17 51.56,28.19 FB1.1
N$2
  Top 0.254: U1.2 43.91,55.4 44.96,54.36 R1.2
N$3
  Top 0.254: U1.3 44.01,56.2 44.7,56.9 R19.2
N$4
  Top 0.254: U10.2 52.7,36.69 52.34,36.32 C14.1 51.56,34.15 FB1.2
N$5
  Top 0.254: J10.2 55.09,28.22 55.12,28.19 FB2.1
N$6
  Top 0.254: U10.3 53.98,36.7 54.34,36.33 C14.2 55.12,34.15 FB2.2
N$7
  Top 0.254: J11.1 41.43,28.17 41.4,28.19 FB3.1
N$8
  Top 0.254: U11.2 42.55,36.69 42.18,36.32 C15.1 41.4,34.15 FB3.2
N$9
  Top 0.254: J11.2 44.93,28.17 44.96,28.19 FB4.1
N$10
  Top 0.254: U11.3 43.81,36.7 44.18,36.33 C15.2 44.96,34.15 FB4.2
N$11
  Top 0.254: J12.1 31.27,28.17 31.24,28.19 FB5.1
N$12
  Top 0.254: U12.2 32.38,36.69 32.02,36.32 C16.1 31.24,34.15 FB5.2
N$13
  Top 0.254: J12.2 34.77,28.17 34.8,28.19 FB6.1
N$14
  Top 0.254: U12.3 33.66,36.69 34.02,36.32 C16.2 34.8,34.15 FB6.2
N$15
  Top 0.254: J13.1 21.11,28.17 21.08,28.19 FB7.1
N$16
  Top 0.254: U13.2 22.23,36.69 21.86,36.32 C17.1 21.08,34.15 FB7.2
N$17
  Top 0.254: J13.2 24.61,28.17 24.64,28.19 FB8.1
N$18
  Top 0.254: U13.3 23.5,36.69 23.86,36.32 C17.2 24.64,34.15 FB8.2
N$19
  Top 0.254: C4.1 45.99,58.4 46.23,58.17 47.75,58.17 48.01,57.91 48.01,56.91 R19.1 50.07,56.9 51.82,58.64 Y1.2
N$20
  Top 0.254: C3.1 45.99,52.85 46.23,53.09 47.75,53.09 48.01,53.34 48.01,54.34 R1.1 50.07,54.36 51.82,52.61 Y1.1
N$21
  Top 0.254: U40.3 19.37,70.68 | 19.37,70.68 19.56,70.87 | 19.56,70.87 21.08,70.87 21.27,70.68 U40.1 | 19.37,71.05 19.56,70.87 | 19.37,70.68 19.37,71.05 | 19.37,71.05 19.32,71.1 C40.1 17.78,72.39 17.64,72.25 D3.C
N$25  (via drill 0.51)
  Top 0.254: R53.2 v51.05,73.91 | D1.A 68.58,85.09 66.55,83.06 v66.55,74.17
  Bottom 0.254: v51.05,73.91 52.07,74.93 54.86,74.93 55.63,74.17 58.42,74.17 v66.55,74.17
N$26  (via drill 0.51)
  Top 0.254: R54.2 v53.34,73.91 | D2.A 68.58,80.01 67.82,79.25 v67.82,73.15
  Bottom 0.254: v53.34,73.91 54.36,73.91 54.74,73.53 63.63,73.53 64.01,73.15 v67.82,73.15
OVP
  Top 0.254: R72.2 19.54,89.39 20.19,90.04 U70.8 20.19,92.08 19.07,93.2 R73.1
POE_PWR
  Top 0.254: U70.5 24.51,91.19 | 27.92,91.18 27.94,91.19 C71.1
  Top 0.813: 35.75,86.81 37.91,86.81 38.16,87.06
  Top 1.27: J2.4 J2.5 55.24,86.36 53.72,87.88 38.99,87.88 38.16,87.06 37.47,86.36 J1.5 | J1.4 J1.5 | 24.51,91.19 27.94,91.19 28.67,91.19 31.96,87.91 34.65,87.91 35.75,86.81 J1.5
  Bottom 0.813: J6.1 10.16,73.66 13.97,77.47 33.66,77.47 J1.4
PWR_IN
  Top 0.254: R61.1 11.18,64.77 | 11.18,64.77 11.18,65.28 | 11.18,64.77 11.68,65.28 | 11.18,64.77 10.67,65.28
  Top 0.813: D3.A 15.75,66.8 14.22,65.28 11.68,65.28 11.18,65.28 10.67,65.28 8.89,65.28 7.62,66.55 | J6.2 7.62,66.55 | 7.62,66.55
PWR_SENSE  (via drill 0.51)
  Top 0.254: U1.12 37.48,63.1 36.32,64.26 v35.31,64.26 | v16.26,65.28 16.26,64.52 16,64.26 C8.1 R60.1 12.73,63.48 12.43,63.19 12.43,61.71 12.19,61.47 12.18,61.48 R61.2
  Bottom 0.254: v35.31,64.26 17.27,64.26 v16.26,65.28
PWR_SRC  (via drill 0.51)
  Top 0.254: v25.14,85.59 v25.15,85.6 | C70.1 26.69,85.11 26.67,85.09 26.17,85.59 v25.14,85.59 | R71.1 25.13,85.58 v25.14,85.59 | 24.38,85.6 24.38,85.59 U70.4
  Top 1.27: v25.15,85.6 24.38,85.6
  Bottom 1.27: v25.15,85.6 20.57,85.6 19.66,84.68 J4.TIP
RST_N  (via drill 0.51)
  Top 0.254: U1.4 43.03,57 v43.18,57.15 | R51.2 65.53,57.91 67.6,59.98 SW1.3 v68.87,55.88 SW1.4 68.83,51.74 68.83,50.55 70.12,49.26 C51.1 68.85,48.26 68.07,47.48 68.07,37.59 68.83,36.83 J5.5
  Bottom 0.254: v43.18,57.15 44.45,55.88 v68.87,55.88
SPI_CS0_N  (via drill 0.51)
  Top 0.254: v56.39,58.42 56.39,48.26 53.98,45.85 U10.6 53.98,43.05 53.34,42.42 49.67,42.42 R10.2 | U1.14 35.88,59.92 36.07,59.73 v36.07,58.93
  Bottom 0.254: v36.07,58.93 54.61,58.93 55.12,58.42 v56.39,58.42
SPI_CS1_N  (via drill 0.51)
  Top 0.254: U1.15 35.08,58.64 v36.07,57.66 | v55.37,57.15 v55.37,49.02 | v43.18,49.02 43.81,48.39 U11.6 43.81,43.05 43.04,42.27 R11.2
  Bottom 0.254: v55.37,49.02 43.43,49.02 43.31,48.9 v43.18,49.02 | v36.07,57.66 42.16,57.66 42.67,58.17 43.43,58.17 44.45,57.15 v55.37,57.15
SPI_CS2_N
  Top 0.254: U1.28 36.68,47.75 36.7,47.73 36.7,47.64 37.08,47.26 37.08,46.74 36.68,46.34 36.68,44.21 35.52,43.05 33.66,43.05 | R12.2 32.88,42.27 33.66,43.05 | 33.66,43.05 U12.6
SPI_CS3_N  (via drill 0.51)
  Top 0.254: R13.2 22.72,42.27 23.5,43.05 U13.6 23.5,46.35 v22.86,46.99 | v32.77,47.5 32.77,49.02 34.28,50.54 U1.25
  Bottom 0.254: v32.77,47.5 23.37,47.5 v22.86,46.99
SPI_MISO  (via drill 0.51)
  Top 0.254: v32,46.48 32,45.47 32.38,45.09 U12.7 | v41.91,46.48 42.55,45.85 U11.7 | v48.77,46.99 49.53,46.23 51.71,46.23 52.7,45.24 U10.7 | U1.27 35.88,46.99 v35.81,46.99 | U13.7 22.23,45.09 22.1,45.21 v22.1,45.97 18.8,45.97 16.89,44.07 R14.2
  Bottom 0.254: v48.77,46.99 48.76,47 44.13,47 43.61,46.48 v41.91,46.48 37.59,46.48 37.08,46.99 v35.81,46.99 34.21,46.99 33.7,46.48 v32,46.48 25.48,46.48 24.97,46.99 24.3,46.99 23.29,45.97 v22.1,45.97
SPI_SCK  (via drill 0.51)
  Top 0.254: U1.26 35.08,48.12 34.8,47.84 v34.8,45.97 34.8,45.21 34.92,45.09 U12.5 | U13.5 24.77,45.09 24.64,45.21 v24.64,45.97 | U11.5 45.09,45.09 44.96,45.21 v44.96,45.97 | U10.5 55.24,45.09 55.37,45.21 v55.37,45.97
  Bottom 0.254: v24.64,45.97 31.16,45.97 31.68,45.45 32.33,45.45 32.85,45.97 v34.8,45.97 41.07,45.97 41.59,45.45 42.23,45.45 42.75,45.97 v44.96,45.97 50.97,45.97 50.99,45.96 52.56,45.96 52.58,45.97 v55.37,45.97
SS
  Top 0.254: C72.1 21.07,83.55 21.46,83.95 U70.2
SWCLK  (via drill 0.51)
  Top 0.254: U1.24 31.76,54.6 31.75,54.61 31.24,54.1 31.24,51.82 30.73,51.31 30.73,46.82 28.7,44.78 v28.7,43.94
  Bottom 0.254: J5.2 68.33,29.21 59.94,37.59 36.07,37.59 29.72,43.94 v28.7,43.94
SWDIO  (via drill 0.51)
  Top 0.254: U1.23 30.51,55.4 29.21,54.1 29.21,51.82 29.72,51.31 29.72,47.5 27.94,45.72 26.92,45.72 v26.16,44.96
  Bottom 0.254: J5.4 65.28,34.29 60.96,38.61 36.83,38.61 29.97,45.47 26.67,45.47 v26.16,44.96
UART1_RX  (via drill 0.51)
  Top 0.254: J7.4 3.3,34.29 2.54,35.05 2.54,40.64 3.49,41.59 6.75,41.59 7.87,42.99 7.87,57.66 v6.86,58.67 | U1.20 31.13,57.8 v30.99,57.66 28.7,57.66 28.46,57.42 R70.2
  Bottom 0.254: v30.99,57.66 7.87,57.66 v6.86,58.67
UART1_TX  (via drill 0.51)
  Top 0.254: v6.86,60.2 8.38,58.67 8.38,38.03 7.18,36.83 J7.5 | v29.72,58.93 30.99,58.93 31.31,58.6 U1.19
  Bottom 0.254: v29.72,58.93 8.13,58.93 v6.86,60.2
UART2_DE1  (via drill 0.51)
  Top 0.254: U1.7 41.41,59.44 43.43,59.44 44.7,60.71 v44.7,66.55 | U30.3 42.55,67.44 42.67,67.31 v42.67,66.55 | R32.1 55.63,68.6 56.64,67.58 v56.64,66.55
  Bottom 0.254: v42.67,66.55 v44.7,66.55 v56.64,66.55
UART2_DE2  (via drill 0.51)
  Top 0.254: U1.11 38.35,61.77 38.35,62.99 v36.07,65.28 36.07,68.19 U31.3 | v28.45,65.28 R33.1
  Bottom 0.254: v28.45,65.28 32.51,65.28 32.77,65.02 33.27,65.02 33.53,65.28 v36.07,65.28
UART2_RE1_N  (via drill 0.51)
  Top 0.254: U1.6 40.2,58.6 39.88,58.93 39.88,60.2 41.27,61.59 v41.27,65.53 U30.2 | R30.2 v48.77,65.02
  Bottom 0.254: v48.77,65.02 46.99,65.02 46.48,65.53 v41.27,65.53
UART2_RE2_N  (via drill 0.51)
  Top 0.254: U1.10 39.08,66.77 v39.12,66.8 | R31.2 v26.16,66.8 | U31.2 34.67,67.56 34.8,67.43 v34.8,66.8
  Bottom 0.254: v39.12,66.8 v34.8,66.8 33.53,66.8 33.27,67.06 32.77,67.06 32.51,66.8 v26.16,66.8
UART2_RX  (via drill 0.51)
  Top 0.254: U30.1 v40.01,65.53 40.01,62.87 39.88,62.74 U1.9 | U31.1 33.4,67.18 33.02,66.8 v33.02,66.04 | v26.92,65.53 26.42,65.02 R34.2
  Bottom 0.254: v40.01,65.53 38.35,65.53 37.59,66.29 35.56,66.29 35.05,65.79 34.54,65.79 34.29,66.04 v33.02,66.04 29.12,66.04 28.87,66.29 27.69,66.29 v26.92,65.53
UART2_TX  (via drill 0.51)
  Top 0.254: U1.8 42.41,60.2 42.42,60.2 42.93,60.71 v42.93,64.52 43.81,65.41 U30.4 | U31.4 37.21,66.8 37.34,66.67 v37.34,65.28
  Bottom 0.254: v42.93,64.52 38.1,64.52 v37.34,65.28
UP_LINK_A  (via drill 0.51)
  Top 0.254: J1.3 40.01,79.63 v39.88,79.5 35.94,75.56 U31.6 | J2.3 57.78,80.39 56.88,79.49 R41.2
  Bottom 0.254: v39.88,79.5 57.15,79.5 57.78,80.14 J2.3
UP_LINK_B  (via drill 0.51)
  Top 0.254: J2.6 53.98,80.14 54.88,79.23 R41.1 | U31.7 34.67,76.33 34.67,76.71 36.2,78.23 36.2,80.26 | 36.2,80.26 36.2,80.52 | 36.2,80.52 36.2,80.77 | 36.2,80.77 J1.6 | v38.61,80.52 36.45,80.52 | 36.45,80.52 36.2,80.52 | 36.2,80.77 36.45,80.52 | 36.45,80.52 36.2,80.26
  Bottom 0.254: v38.61,80.52 53.34,80.52 53.98,81.15 J2.6
USB_DM  (via drill 0.51)
  Top 0.254: J3.2 5.73,56.78 6.1,57.15 v6.86,57.15 | U1.21 34.4,57 v34.53,57.14
  Bottom 0.254: v34.53,57.14 33.77,57.14 33.27,56.64 7.37,56.64 v6.86,57.15
USB_DP  (via drill 0.51)
  Top 0.254: J3.3 5.84,56.13 6.1,55.88 v6.86,55.88 | U1.22 33.97,56.2 v34.54,55.63
  Bottom 0.254: v6.86,55.88 7.11,56.13 33.19,56.13 33.7,55.63 v34.54,55.63
USB_ID  (via drill 0.51)
  Top 0.254: J3.4 3.15,55.48 2.75,55.09 2.75,53.94 2.7,53.89 2.7,51.98 2.75,51.92 2.75,50.29 3.52,49.53 v3.56,49.53
USB_VBUS
  Top 0.254: J3.1 5.62,57.43 5.84,57.66 5.84,58.67 5.59,58.93 5.59,59.69
  Top 0.813: J6.3 5.08,66.04 5.59,65.53 5.59,59.69
  Bottom 0.813: J6.3 5.08,66.04 1.78,62.74 1.78,33.02 3.05,31.75 J7.3
UV
  Top 0.254: R72.1 19.29,87.39 19.3,87.38 19.81,87.88 19.81,88.65 20.83,89.66 22.1,89.66 22.73,89.03 U70.3 22.73,84.2 23.11,83.82 23.11,82.57 R71.2

### Text on the board
tPlace: Red - | Yellow + | Red - | Yellow + | Red - | Yellow + | Red - | Yellow +
tNames: GND | CTR POS | USB | POE | USER | RESET | GND | GND | (SWO) | (RTS) | NRST | TX OUT | SWDIO | RX IN | GND | UART | 5V IN | SWCLK | (CTS) | ST-LINK | 3.3V | GND | CHAN 3 | CHAN 0 | 4 CH THERMOCOUPLE | MAX31855 | PCB101 REV A